# EAGLE design MainBoard (EAGLE 5.06)
TITLE: Matrix Main Board

## Sheet 1 of 2
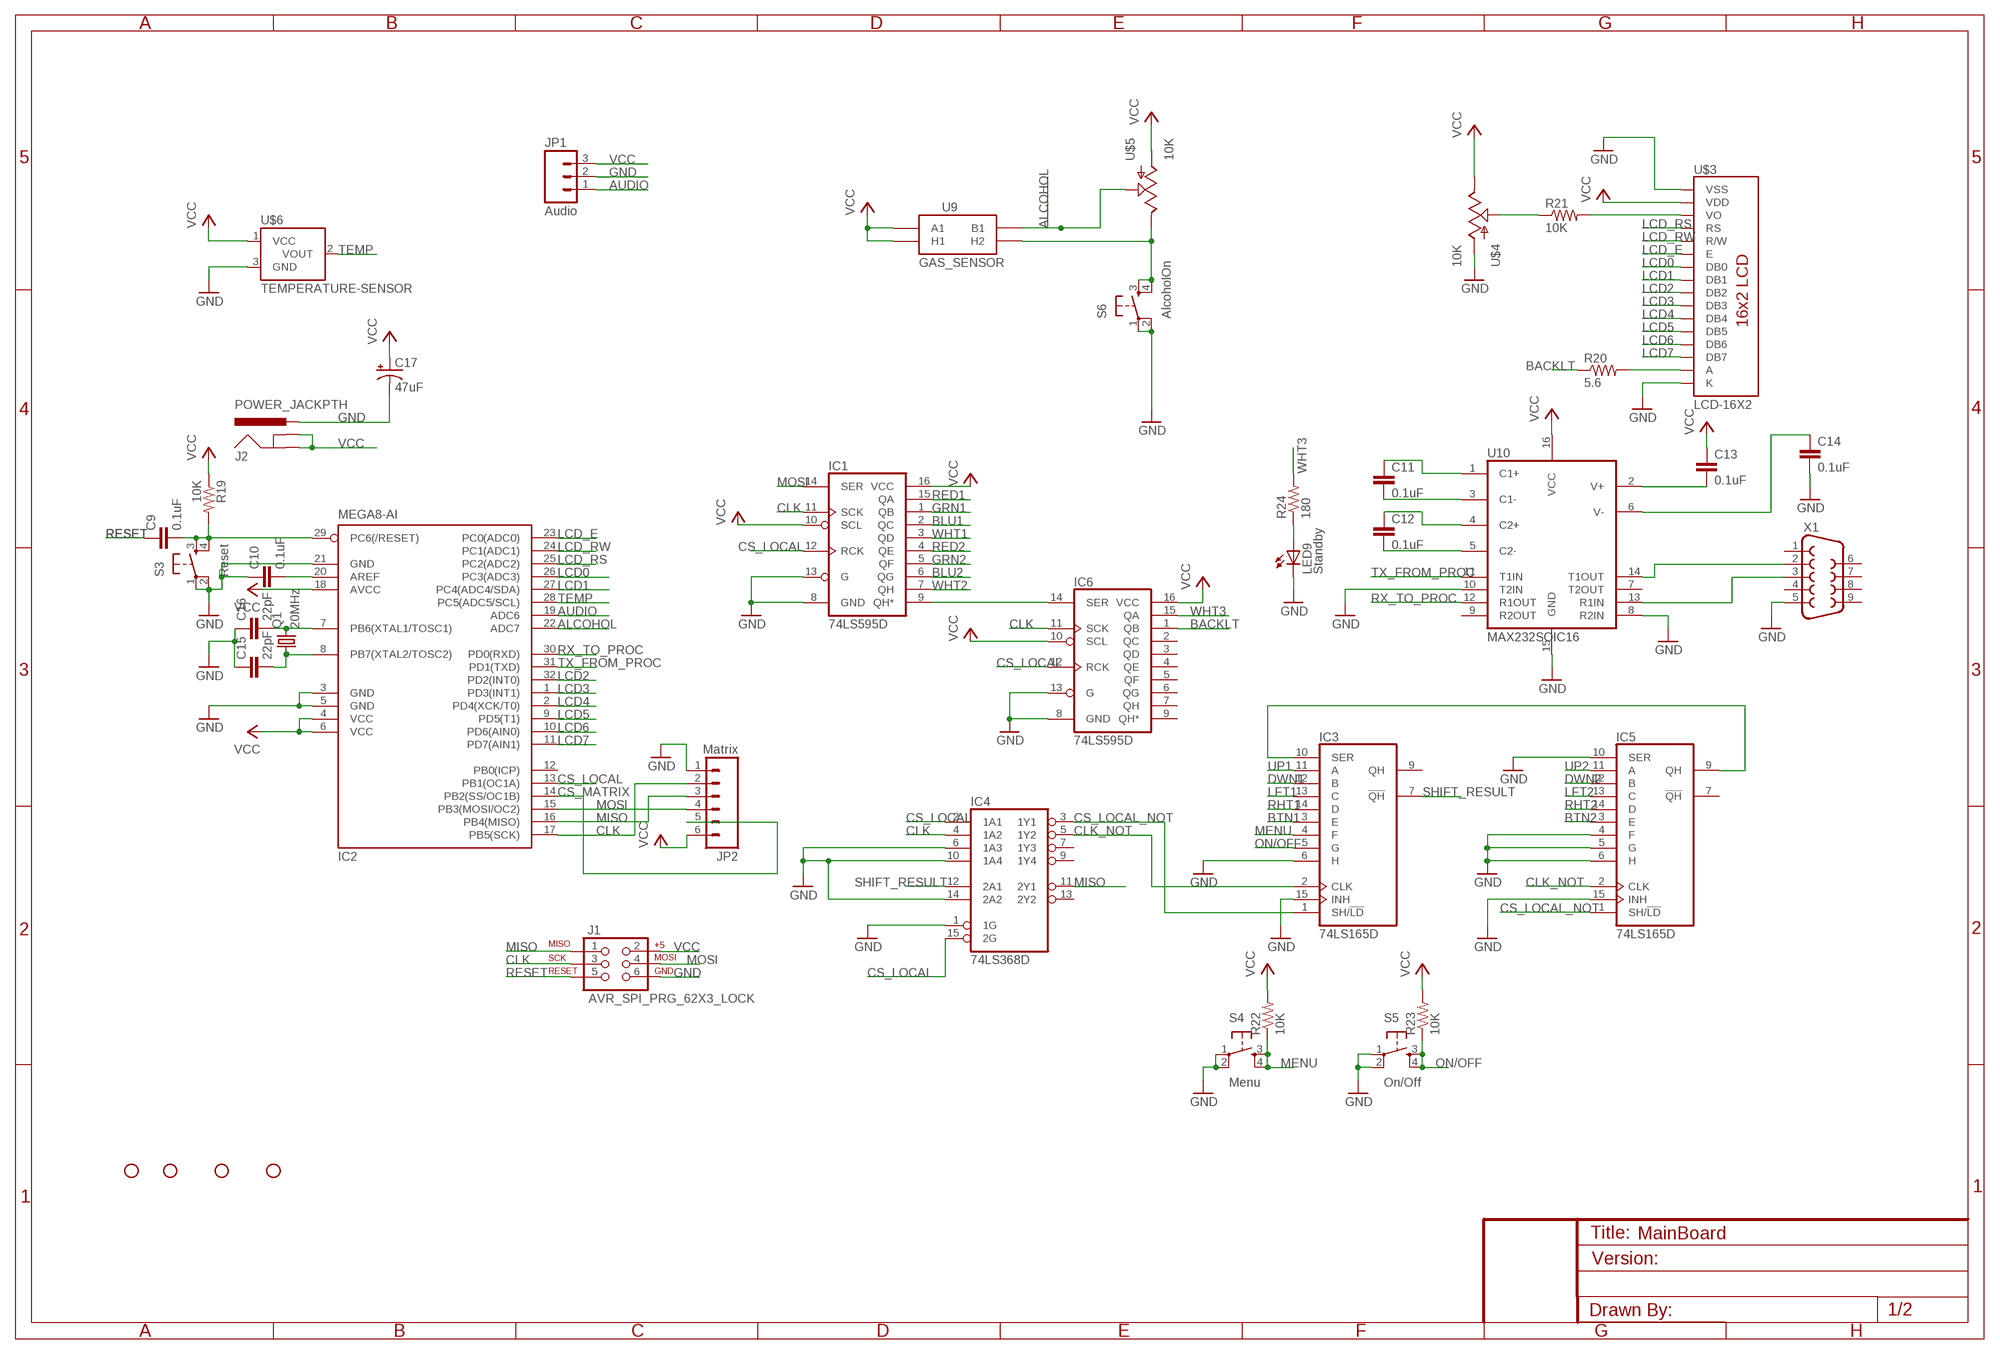
[diagram p0: schematic, sheet 1]

### Parts
C9  0.1uF  CAP0402-CAP  [0402-CAP]
C10  0.1uF  CAP0402-CAP  [0402-CAP]
C11  0.1uF  CAP0402-CAP  [0402-CAP]
C12  0.1uF  CAP0402-CAP  [0402-CAP]
C13  0.1uF  CAP0402-CAP  [0402-CAP]
C14  0.1uF  CAP0402-CAP  [0402-CAP]
C15  22pF  CAP0402-CAP  [0402-CAP]
C16  22pF  CAP0402-CAP  [0402-CAP]
C17  47uF  CAP_POLPTH2  [CPOL-RADIAL-10UF-25V]
IC1  74LS595D  [SO16]
IC2  MEGA8-AI  [TQFP32-08]
IC3  74LS165D  [SO16]
IC4  74LS368D  [SO16]
IC5  74LS165D  [SO16]
IC6  74LS595D  [SO16]
J1  AVR_SPI_PRG_62X3_LOCK  [2X3_LOCK]
J2  POWER_JACKPTH  [POWER_JACK_PTH]
JP1  Audio  M03PTH  [1X03]
JP2  Matrix  M06SIP  [1X06]
JP3  STAND-OFF  [STAND-OFF]
JP4  STAND-OFF  [STAND-OFF]
JP5  STAND-OFF  [STAND-OFF]
JP6  STAND-OFF  [STAND-OFF]
LED9  Standby  LED0603  [LED-0603]
Q1  20MHz  CRYSTALHC49US  [HC49US]
R19  10K  RESISTOR0402-RES  [0402-RES]
R20  5.6  RESISTOR0402-RES  [0402-RES]
R21  10K  RESISTOR0402-RES  [0402-RES]
R22  10K  RESISTOR0402-RES  [0402-RES]
R23  10K  RESISTOR0402-RES  [0402-RES]
R24  180  RESISTOR0402-RES  [0402-RES]
S3  Reset  TAC_SWITCHSMD  [TACTILE_SWITCH_SMD]
S4  Menu  TAC_SWITCHPTH  [TACTILE-PTH]
S5  On/Off  TAC_SWITCHPTH  [TACTILE-PTH]
S6  AlcoholOn  TAC_SWITCHSMD  [TACTILE_SWITCH_SMD]
U9  GAS_SENSOR  [MQ-3]
U10  MAX232SOIC16  [SO016]
U$3  LCD-16X2  [LCD-16X2]
U$4  10K  POTTRIM  [TRIM_POT]
U$5  10K  POTTRIM  [TRIM_POT]
U$6  TEMPERATURE-SENSOR  [TO-92]
X1  DB9  [DB9]

### Nets
ALCOHOL: IC2.22(ADC7) U9.B1 U$5.1(S)
AUDIO: IC2.19(ADC6) JP1.1
BACKLT: IC6.1(QB) R20.1
BLU1: IC1.2(QC) ; also sheet 2
BLU2: IC1.6(QG) ; also sheet 2
BTN1: IC3.3(E) ; also sheet 2
BTN2: IC5.3(E) ; also sheet 2
CLK: IC1.11(SCK) IC2.17(PB5(SCK)) IC4.4(1A2) IC6.11(SCK) J1.3 JP2.2
CLK_NOT: IC3.2(CLK) IC4.5(1Y2) IC5.2(CLK)
CS_LOCAL: IC1.12(RCK) IC2.13(PB1(OC1A)) IC4.2(1A1) IC4.15(2G) IC6.12(RCK)
CS_LOCAL_NOT: IC3.1(SH/!LD) IC4.3(1Y1) IC5.1(SH/!LD)
CS_MATRIX: IC2.14(PB2(SS/OC1B)) JP2.5
DWN1: IC3.12(B) ; also sheet 2
DWN2: IC5.12(B) ; also sheet 2
GND: C10.1 C14.2 C15.1 C16.1 C17.2(-) IC1.8(GND) IC1.13(G) IC2.3(GND) IC2.5(GND) IC2.21(GND) IC3.6(H) IC3.15(INH) IC4.1(1G) IC4.6(1A3) IC4.10(1A4) IC4.14(2A2) IC5.4(F) IC5.5(G) IC5.6(H) IC5.10(SER) IC5.15(INH) IC6.8(GND) IC6.13(G) J1.6 J2.PWR JP1.2 JP2.1 LED9.C S3.1 S3.2 S4.1 S4.2 S5.1 S5.2 S6.1 S6.2 U10.8(R2IN) U10.10(T2IN) U10.15(GND) U$3.1(VSS) U$3.16(K) U$4.3(A) U$6.3(GND) X1.5 ; also sheet 2
GRN1: IC1.1(QB) ; also sheet 2
GRN2: IC1.5(QF) ; also sheet 2
LCD0: IC2.26(PC3(ADC3)) U$3.7(DB0)
LCD1: IC2.27(PC4(ADC4/SDA)) U$3.8(DB1)
LCD2: IC2.32(PD2(INT0)) U$3.9(DB2)
LCD3: IC2.1(PD3(INT1)) U$3.10(DB3)
LCD4: IC2.2(PD4(XCK/T0)) U$3.11(DB4)
LCD5: IC2.9(PD5(T1)) U$3.12(DB5)
LCD6: IC2.10(PD6(AIN0)) U$3.13(DB6)
LCD7: IC2.11(PD7(AIN1)) U$3.14(DB7)
LCD_E: IC2.23(PC0(ADC0)) U$3.6(E)
LCD_RS: IC2.25(PC2(ADC2)) U$3.4(RS)
LCD_RW: IC2.24(PC1(ADC1)) U$3.5(R/W)
LFT1: IC3.13(C) ; also sheet 2
LFT2: IC5.13(C) ; also sheet 2
MENU: IC3.4(F) R22.1 S4.3 S4.4
MISO: IC2.16(PB4(MISO)) IC4.11(2Y1) J1.1 JP2.3
MOSI: IC1.14(SER) IC2.15(PB3(MOSI/OC2)) J1.4 JP2.4
N$5: LED9.A R24.1
N$6: C11.1 U10.1(C1+)
N$7: C9.2 IC2.29(PC6(/RESET)) R19.2 S3.3 S3.4
N$8: C10.2 IC2.20(AREF)
N$9: C11.2 U10.3(C1-)
N$14: C16.2 IC2.7(PB6(XTAL1/TOSC1)) Q1.2
N$15: S6.3 S6.4 U9.HB(H2) U$5.2(E)
N$16: IC3.10(SER) IC5.9(QH)
N$17: R21.2 U$3.3(VO)
N$18: R21.1 U$4.1(S)
N$19: C12.1 U10.4(C2+)
N$20: R20.2 U$3.15(A)
N$21: C12.2 U10.5(C2-)
N$22: C14.1 U10.6(V-)
N$23: C13.2 U10.2(V+)
N$24: U10.14(T1OUT) X1.2
N$25: U10.13(R1IN) X1.3
N$26: C15.2 IC2.8(PB7(XTAL2/TOSC2)) Q1.1
N$27: IC1.9(QH*) IC6.14(SER)
ON/OFF: IC3.5(G) R23.1 S5.3 S5.4
RED1: IC1.15(QA) ; also sheet 2
RED2: IC1.4(QE) ; also sheet 2
RESET: C9.1 J1.5
RHT1: IC3.14(D) ; also sheet 2
RHT2: IC5.14(D) ; also sheet 2
RX_TO_PROC: IC2.30(PD0(RXD)) U10.12(R1OUT)
SHIFT_RESULT: IC3.7(!QH) IC4.12(2A1)
TEMP: IC2.28(PC5(ADC5/SCL)) U$6.2(VOUT)
TX_FROM_PROC: IC2.31(PD1(TXD)) U10.11(T1IN)
UP1: IC3.11(A) ; also sheet 2
UP2: IC5.11(A) ; also sheet 2
VCC: C13.1 C17.1(+) IC1.10(SCL) IC1.16(VCC) IC2.4(VCC) IC2.6(VCC) IC2.18(AVCC) IC6.10(SCL) IC6.16(VCC) J1.2 J2.GND J2.GNDBREAK JP1.3 JP2.6 R19.1 R22.2 R23.2 U9.A1 U9.HA(H1) U10.16(VCC) U$3.2(VDD) U$4.2(E) U$5.3(A) U$6.1(VCC) ; also sheet 2
WHT1: IC1.3(QD) ; also sheet 2
WHT2: IC1.7(QH) ; also sheet 2
WHT3: IC6.15(QA) R24.2
Unconnected: IC2.12(PB0(ICP)) IC3.9(QH) IC4.7(1Y3) IC4.9(1Y4) IC4.13(2Y2) IC5.7(!QH) IC6.2(QC) IC6.3(QD) IC6.4(QE) IC6.5(QF) IC6.6(QG) IC6.7(QH) IC6.9(QH*) U10.7(T2OUT) U10.9(R2OUT) X1.1 X1.4 X1.6 X1.7 X1.8 X1.9

## Sheet 2 of 2
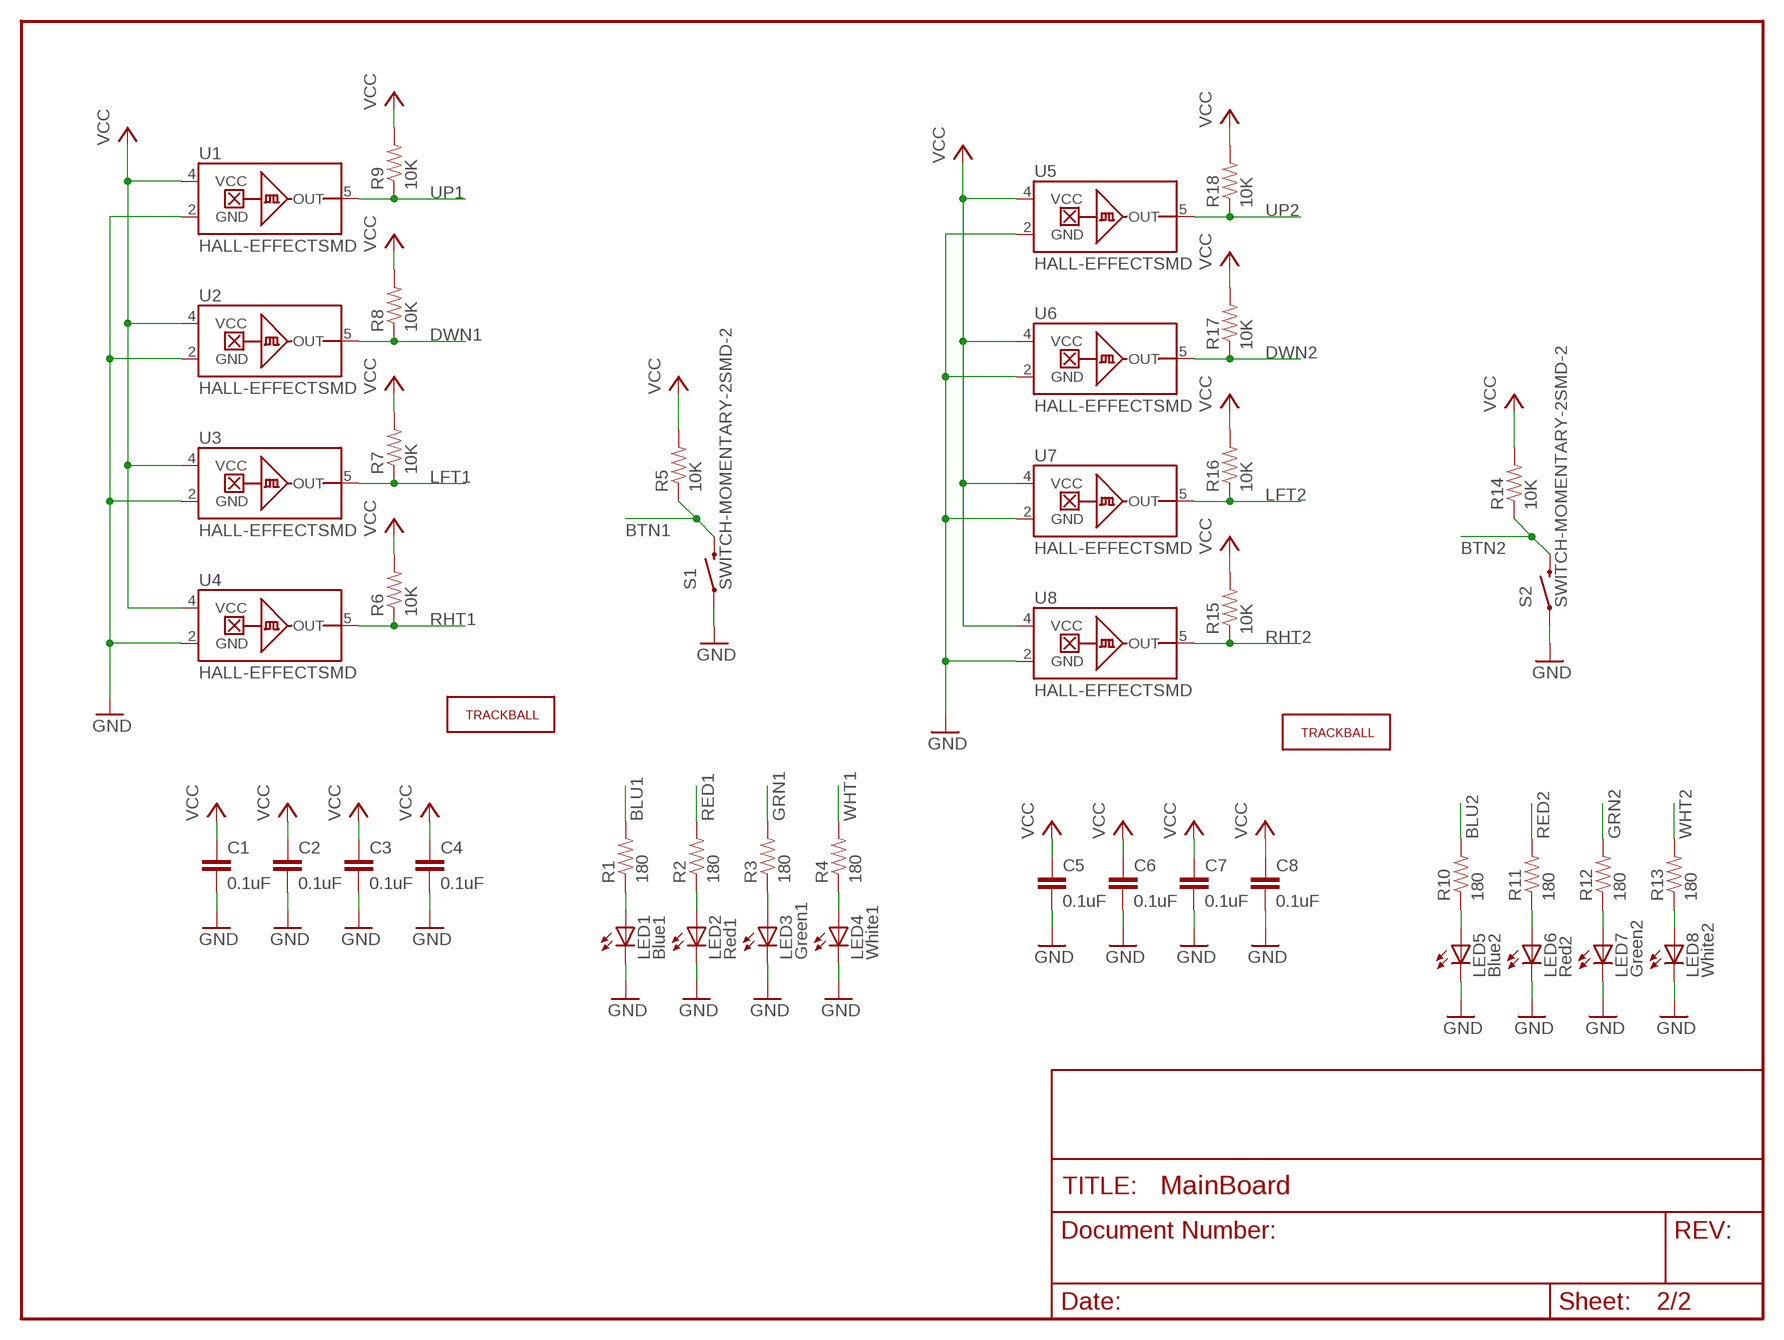
[diagram p1: schematic, sheet 2]

### Parts
C1  0.1uF  CAP0402-CAP  [0402-CAP]
C2  0.1uF  CAP0402-CAP  [0402-CAP]
C3  0.1uF  CAP0402-CAP  [0402-CAP]
C4  0.1uF  CAP0402-CAP  [0402-CAP]
C5  0.1uF  CAP0402-CAP  [0402-CAP]
C6  0.1uF  CAP0402-CAP  [0402-CAP]
C7  0.1uF  CAP0402-CAP  [0402-CAP]
C8  0.1uF  CAP0402-CAP  [0402-CAP]
LED1  Blue1  LED0603  [LED-0603]
LED2  Red1  LED0603  [LED-0603]
LED3  Green1  LED0603  [LED-0603]
LED4  White1  LED0603  [LED-0603]
LED5  Blue2  LED0603  [LED-0603]
LED6  Red2  LED0603  [LED-0603]
LED7  Green2  LED0603  [LED-0603]
LED8  White2  LED0603  [LED-0603]
R1  180  RESISTOR0402-RES  [0402-RES]
R2  180  RESISTOR0402-RES  [0402-RES]
R3  180  RESISTOR0402-RES  [0402-RES]
R4  180  RESISTOR0402-RES  [0402-RES]
R5  10K  RESISTOR0402-RES  [0402-RES]
R6  10K  RESISTOR0402-RES  [0402-RES]
R7  10K  RESISTOR0402-RES  [0402-RES]
R8  10K  RESISTOR0402-RES  [0402-RES]
R9  10K  RESISTOR0402-RES  [0402-RES]
R10  180  RESISTOR0402-RES  [0402-RES]
R11  180  RESISTOR0402-RES  [0402-RES]
R12  180  RESISTOR0402-RES  [0402-RES]
R13  180  RESISTOR0402-RES  [0402-RES]
R14  10K  RESISTOR0402-RES  [0402-RES]
R15  10K  RESISTOR0402-RES  [0402-RES]
R16  10K  RESISTOR0402-RES  [0402-RES]
R17  10K  RESISTOR0402-RES  [0402-RES]
R18  10K  RESISTOR0402-RES  [0402-RES]
S1  SWITCH-MOMENTARY-2SMD-2  [TACTILE_SWITCH_SMD-2]
S2  SWITCH-MOMENTARY-2SMD-2  [TACTILE_SWITCH_SMD-2]
U1  HALL-EFFECTSMD  [SC70]
U2  HALL-EFFECTSMD  [SC70]
U3  HALL-EFFECTSMD  [SC70]
U4  HALL-EFFECTSMD  [SC70]
U5  HALL-EFFECTSMD  [SC70]
U6  HALL-EFFECTSMD  [SC70]
U7  HALL-EFFECTSMD  [SC70]
U8  HALL-EFFECTSMD  [SC70]
U$1  TRACKBALLMECH  [TRACKBALL]
U$2  TRACKBALLMECH  [TRACKBALL]

### Nets
BLU1: R1.2 ; also sheet 1
BLU2: R10.2 ; also sheet 1
BTN1: R5.1 S1.1 ; also sheet 1
BTN2: R14.1 S2.1 ; also sheet 1
DWN1: R8.1 U2.5(OUT) ; also sheet 1
DWN2: R17.1 U6.5(OUT) ; also sheet 1
GND: C1.2 C2.2 C3.2 C4.2 C5.2 C6.2 C7.2 C8.2 LED1.C LED2.C LED3.C LED4.C LED5.C LED6.C LED7.C LED8.C S1.2 S2.2 U1.2(GND) U2.2(GND) U3.2(GND) U4.2(GND) U5.2(GND) U6.2(GND) U7.2(GND) U8.2(GND) ; also sheet 1
GRN1: R3.2 ; also sheet 1
GRN2: R12.2 ; also sheet 1
LFT1: R7.1 U3.5(OUT) ; also sheet 1
LFT2: R16.1 U7.5(OUT) ; also sheet 1
N$1: LED1.A R1.1
N$2: LED2.A R2.1
N$3: LED3.A R3.1
N$4: LED4.A R4.1
N$10: LED5.A R10.1
N$11: LED6.A R11.1
N$12: LED7.A R12.1
N$13: LED8.A R13.1
RED1: R2.2 ; also sheet 1
RED2: R11.2 ; also sheet 1
RHT1: R6.1 U4.5(OUT) ; also sheet 1
RHT2: R15.1 U8.5(OUT) ; also sheet 1
UP1: R9.1 U1.5(OUT) ; also sheet 1
UP2: R18.1 U5.5(OUT) ; also sheet 1
VCC: C1.1 C2.1 C3.1 C4.1 C5.1 C6.1 C7.1 C8.1 R5.2 R6.2 R7.2 R8.2 R9.2 R14.2 R15.2 R16.2 R17.2 R18.2 U1.4(VCC) U2.4(VCC) U3.4(VCC) U4.4(VCC) U5.4(VCC) U6.4(VCC) U7.4(VCC) U8.4(VCC) ; also sheet 1
WHT1: R4.2 ; also sheet 1
WHT2: R13.2 ; also sheet 1

## Power pins joined to a net without a drawn wire
GND: IC3.8(GND) IC4.8(GND) IC5.8(GND)
VCC: IC3.16(VCC) IC4.16(VCC) IC5.16(VCC)

## Library data of the parts
C1-C16 = SparkFun:CAP: Capacitor Standard 0603 ceramic capacitor, and 0.1" leaded capacitor.
C17 = SparkFun:CAP_POL: Capacitor Polarized These are standard SMD and PTH capacitors. Normally 10uF, 47uF, and 100uF in electrolytic and tantalum varieties. Always verify the external diameter of the through hole cap, it varies with capacity, voltage, and manufacturer. The EIA devices should be standard.
IC1 IC6 = SparkFun:74*595: 8-bit SHIFT REGISTER, output latch
IC2 = atmel:MEGA8: MICROCONTROLLER 8 Kbytes FLASH, 1 kbytes SRAM, 512 bytes EEPROM, USART, 6-channel 10 bit ADC, 2-channel 8 bit ADC Pin compatible with Atmega48, ATMega88, ATMega168 Source: avr.lbr
IC3 IC5 = 74xx-us:74*165: 8-bit parallel load SHIFT REGISTER
IC4 = 74xx-us:74*368: Hex BUS DRIVER, 3-state
J1 = SparkFun:AVR_SPI_PRG_6: AVR ISP 6 Pin This is the reduced ISP connector for AVR programming. Common on Arduino. This footprint will take up less PCB space and can be used with a 10-pin to 6-pin adapter such as SKU: BOB-08508
J2 = SparkFun:POWER_JACK: Power Jack This is the standard 5.5mm barrel jack for power. The PTH is the most common, proven, reliable, footprint. All others are experimental. The Slot footprint only works if the mill layer is transmitted to the PCB fab house so be warned. Spark Fun Electronics SKU : PRT-00119. Mating wall wart : TOL-00298 (and others)
JP1 = SparkFun:M03: Header 3 Standard 3-pin 0.1" header. Use with straight break away headers (SKU : PRT-00116), right angle break away headers (PRT-00553), swiss pins (PRT-00743), machine pins (PRT-00117), and female headers (PRT-00115). Molex polarized connector foot print use with SKU : PRT-08232 with associated crimp pins and housings.
JP2 = SparkFun:M06: Header 6 Standard 6-pin 0.1" header. Use with straight break away headers (SKU : PRT-00116), right angle break away headers (PRT-00553), swiss pins (PRT-00743), machine pins (PRT-00117), and female headers (PRT-00115). Molex polarized connector foot print use with SKU : PRT-08094 with associated crimp pins and housings. NOTES ON THE VARIANTS LOCK and LOCK_LONGPADS... This footprint was designed to help hold the alignment of a through-hole component (i.e. 6-pin header) while soldering it into place. You may notice that each hole has been shifted either up or down by 0.005 of an inch from it's more standard position (which is a perfectly straight line). This slight alteration caused the pins (the squares in the middle) to touch the edges of the holes. Because they are alternating, it causes a "brace" to hold the component in place. 0.005 has proven to be the perfect amount of "off-center" position when using our standard breakaway headers. Although looks a little odd when you look at the bare footprint, once you have a header in there, the alteration is very hard to notice. Also, if you push a header all the way into place, it is covered up entirely on the bottom side. This idea of altering the position of holes to aid alignment will be further integrated into the Sparkfun Library for other footprints. It can help hold any component with 3 or more connection pins.
JP3-JP6 = SparkFun:STAND-OFF: Stand Off This is the mechanical footprint for a #4 phillips button head screw. Use the keepout ring to avoid running the screw head into surrounding components. SKU : PRT-00447
LED1-LED9 = SparkFun:LED: LEDs Standard schematic elements and footprints for 5mm, 3mm, 1206, and 0603 sized LEDs. 5mm - Spark Fun Electronics SKU : COM-00529 (and others)
Q1 = SparkFun:CRYSTAL: Crystals Various standard crystals. Proven footprints. Spark Fun Electronics SKU : COM-00534
R1-R24 = SparkFun:RESISTOR: Resistor Basic schematic elements and footprints for 0603, 1206, and PTH 1/10th watt (small) resistors.
S1 S2 = SparkFun:SWITCH-MOMENTARY-2
S3-S6 = SparkFun:TAC_SWITCH: Momentary Switch Button commonly used for reset or general input. Spark Fun Electronics SKU : COM-00097
U1-U8 = SparkFun:HALL-EFFECT
U9 = SparkFun:GAS_SENSOR: MQ-3 Gas Sensor. FP not tested. Part#
U10 = SparkFun:MAX232: RS232 Transceiver Very common IC. This is generically called 'MAX232', but works with the 3V equivalent MAX3232 generic ICs. Field tested and mother approved. Spark Fun Electronics SKU : COM-00316 (DIP) and COM-00589 (SMD)
U$1 U$2 = SparkFun:TRACKBALL
U$3 = SparkFun:LCD-16X2
U$4 U$5 = SparkFun:POT
U$6 = SparkFun:TEMPERATURE-SENSOR
X1 = SparkFun:DB9: DB9 Connector Standard DB9 (D-Sub 9) serial connector. Can be used for CAN bus as well as RS485 and RS232. Footprint production proven. Spark Fun Electronics SKU : PRT-00429

## Board
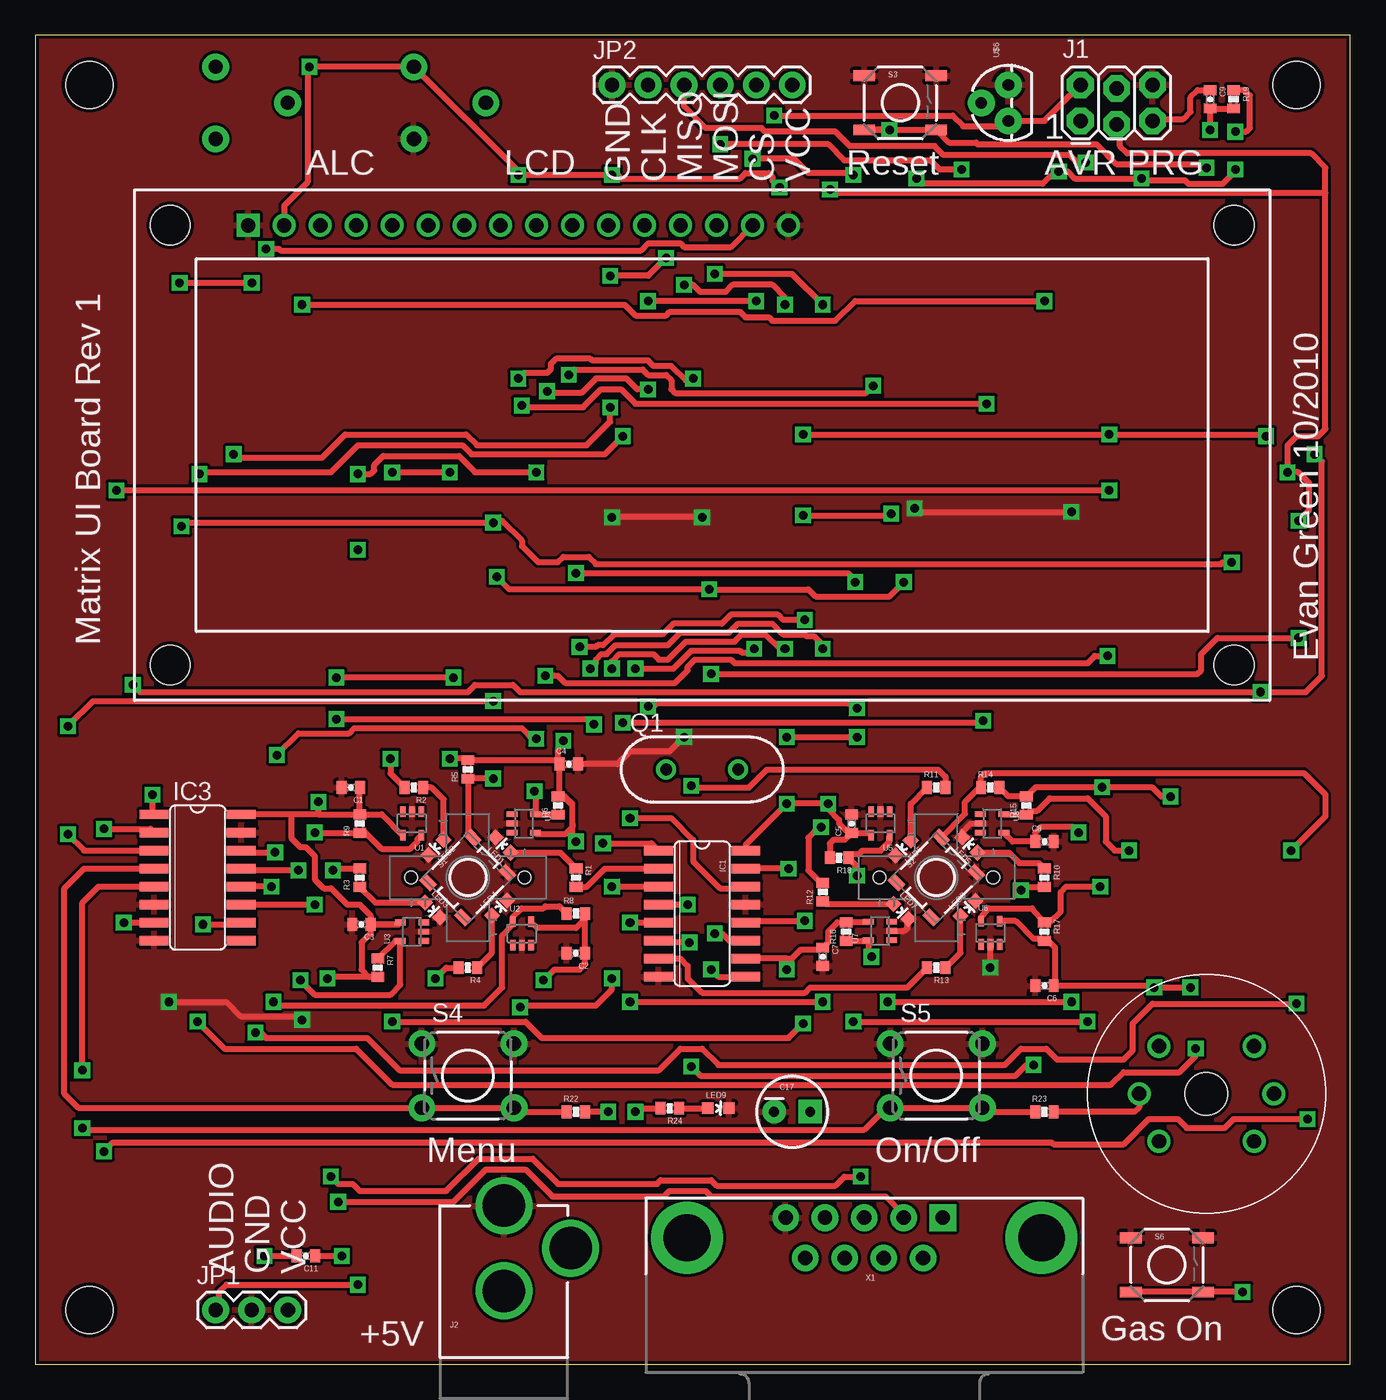
[diagram p2: board, top side]
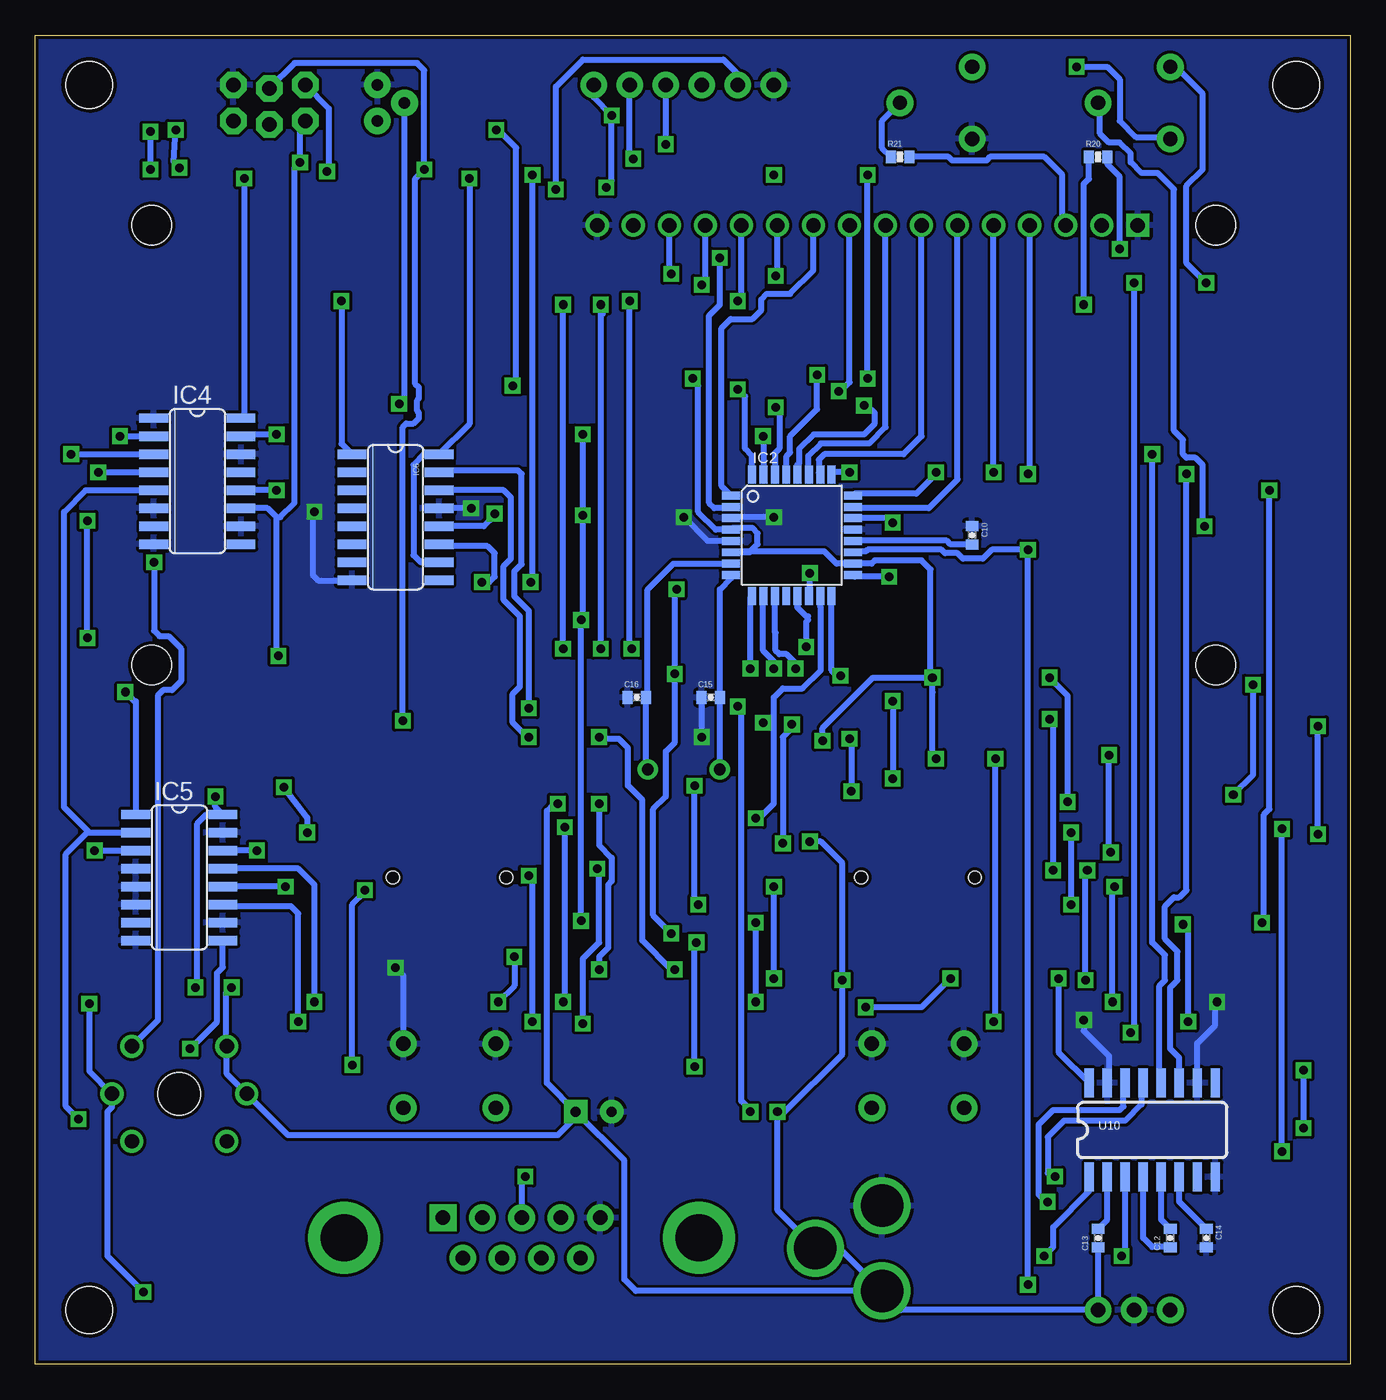
[diagram p3: board, bottom side, seen from below]

Size 92.69 x 93.65 mm. Coordinates in mm from the lower left corner, seen from the top.
Outline: 0,0 92.69,0 92.69,93.65 0,93.65 0,0
Copper layers (1*16): Top 0.035mm / dielectric 1.5mm / Bottom 0.035mm
Design rules "SparkFun": minimum track width 8mil, minimum drill 20mil, track to track 8mil, track to pad 8mil, pad to pad 8mil, via to via 8mil, smd to smd 8mil, copper to edge 10mil, drill to drill 8mil, minimum pad ring 12mil, minimum via ring 10mil, stop-mask expansion 4mil, vias tented up to drill 25mil, thermal gap 10mil

### Footprints (pad centres in the part's own frame; a part is rotated, then mirrored left to right if it is on the bottom)
0402-CAP = smd 0.7 x 0.9: 1 -0.65,0; 2 0.65,0
CPOL-RADIAL-10UF-25V = drill 0.7 pad 1.651 square: 1 1.27,0 | drill 0.7 pad 1.651 round: 2 -1.27,0
SO16 = smd 0.66 x 2.032: 1 -4.445,-3.073; 2 -3.175,-3.073; 3 -1.905,-3.073; 4 -0.635,-3.073; 5 0.635,-3.073; 6 1.905,-3.073; 7 3.175,-3.073; 8 4.445,-3.073; 9 4.445,3.073; 10 3.175,3.073; 11 1.905,3.073; 12 0.635,3.073; 13 -0.635,3.073; 14 -1.905,3.073; 15 -3.175,3.073; 16 -4.445,3.073
TQFP32-08 = smd 1.27 x 0.559: 1 -4.293,2.8; 2 -4.293,2; 3 -4.293,1.2; 4 -4.293,0.4; 5 -4.293,-0.4; 6 -4.293,-1.2; 7 -4.293,-2; 8 -4.293,-2.8; 17 4.293,-2.8; 18 4.293,-2; 19 4.293,-1.2; 20 4.293,-0.4; 21 4.293,0.4; 22 4.293,1.2; 23 4.293,2; 24 4.293,2.8 | smd 0.559 x 1.27: 9 -2.8,-4.293; 10 -2,-4.293; 11 -1.2,-4.293; 12 -0.4,-4.293; 13 0.4,-4.293; 14 1.2,-4.293; 15 2,-4.293; 16 2.8,-4.293; 25 2.8,4.293; 26 2,4.293; 27 1.2,4.293; 28 0.4,4.293; 29 -0.4,4.293; 30 -1.2,4.293; 31 -2,4.293; 32 -2.8,4.293
2X3_LOCK = drill 1.016 pad 1.88 octagon: 1 0,0; 2 0,2.54; 3 2.54,-0.254; 4 2.54,2.286; 5 5.08,0; 6 5.08,2.54
POWER_JACK_PTH = drill 2.997 round: GND 0,7.7; GNDBREAK 4.7,10.7; PWR 0,13.7
1X03 = drill 1.016 pad 1.88 round: 1 0,0; 2 2.54,0; 3 5.08,0
1X06 = drill 1.016 pad 1.88 round: 1 0,0; 2 2.54,0; 3 5.08,0; 4 7.62,0; 5 10.16,0; 6 12.7,0
STAND-OFF = hole 3.302: 0,0
LED-0603 = smd 0.8 x 0.8: A 0,-0.75; C 0,0.75
HC49US = drill 0.813 round: 1 -2.54,0; 2 2.54,0
0402-RES = smd 0.7 x 0.9: 1 -0.65,0; 2 0.65,0
TACTILE_SWITCH_SMD-2 = smd 0.7 x 1.1: 1 2.225,1.75; 2 2.225,-1.75; 3 -2.225,-1.75; 4 -2.225,1.75
TACTILE_SWITCH_SMD = smd 1.524 x 0.762: 1 -2.54,1.905; 2 2.54,1.905; 3 -2.54,-1.905; 4 2.54,-1.905
TACTILE-PTH = drill 1.016 pad 1.88 round: 1 -3.251,2.261; 2 3.251,2.261; 3 -3.251,-2.261; 4 3.251,-2.261
SC70 = smd 0.4 x 0.75: 1 -0.65,-0.825; 2 0,-0.825; 3 0.65,-0.825; 4 0.65,0.825; 5 -0.65,0.825
MQ-3 = drill 1.016 round: A1 -3.35,3.35; A2 -3.35,-3.35; B1 3.35,3.35; B2 3.35,-3.35; HA -4.75,0; HB 4.75,0 | hole 3: 0,0
SO016 = smd 0.66 x 2.032: 1 -4.445,-3.315; 2 -3.175,-3.315; 3 -1.905,-3.315; 4 -0.635,-3.315; 5 0.635,-3.315; 6 1.905,-3.315; 7 3.175,-3.315; 8 4.445,-3.315; 9 4.445,3.315; 10 3.175,3.315; 11 1.905,3.315; 12 0.635,3.315; 13 -0.635,3.315; 14 -1.905,3.315; 15 -3.175,3.315; 16 -4.445,3.315
TRACKBALL = hole 0.9: -4,0; 4,0
LCD-16X2 = drill 1.016 square: 1 -32,15.5 | drill 1.016 round: 2 -29.46,15.5; 3 -26.92,15.5; 4 -24.38,15.5; 5 -21.84,15.5; 6 -19.3,15.5; 7 -16.76,15.5; 8 -14.22,15.5; 9 -11.68,15.5; 10 -9.14,15.5; 11 -6.6,15.5; 12 -4.06,15.5; 13 -1.52,15.5; 14 1.02,15.5; 15 3.56,15.5; 16 6.1,15.5 | hole 2.8: -37.5,15.5; -37.5,-15.5; 37.5,15.5; 37.5,-15.5
TRIM_POT = drill 1 pad 1.88 round: 1 5.08,0; 2 0,2.54; 3 0,-2.54
TO-92 = drill 0.813 pad 1.88 round: 1 -1.27,0; 2 0,1.905; 3 1.27,0
DB9 = drill 1.016 pad 1.88 square: 1 -5.54,-1.42 | drill 1.016 pad 1.88 round: 2 -2.77,-1.42; 3 0,-1.42; 4 2.77,-1.42; 5 5.54,-1.42; 6 -4.15,1.42; 7 -1.38,1.42; 8 1.38,1.42; 9 4.15,1.42 | drill 3.302 pad 5.08 round: G1 -12.5,0; G2 12.5,0

### Placement (x,y rotation side)
C1  22.23,40.64 180 top
C2  38.1,28.96 180 top
C3  22.99,30.99 180 top
C4  37.59,42.29 0 top
C5  57.53,38.1 90 top
C6  71.12,26.67 180 top
C7  55.5,28.7 270 top
C8  71.12,36.83 0 top
C9  82.8,89.15 270 top
C10  26.67,58.42 270 bottom
C11  19.05,7.62 180 top
C12  12.7,8.89 90 bottom
C13  17.78,8.89 90 bottom
C14  10.16,8.89 270 bottom
C15  45.09,46.99 0 bottom
C16  50.29,46.99 0 bottom
C17  53.34,17.78 0 top
IC1  46.99,31.75 270 top
IC2  39.37,58.42 0 bottom
IC3  11.43,34.29 270 top
IC4  81.28,62.23 270 bottom
IC5  82.55,34.29 270 bottom
IC6  67.31,59.69 270 bottom
J1  73.66,87.63 0 top
J2  33.02,-2.54 0 top
JP1  12.7,3.81 0 top
JP2  40.64,90.17 0 top
JP3  3.81,3.81 0 top
JP4  88.9,3.81 0 top
JP5  88.9,90.17 0 top
JP6  3.81,90.17 0 top
LED1  32.97,36.58 45 top
LED2  28.24,36.42 135 top
LED3  27.99,32 225 top
LED4  32.72,32.16 315 top
LED5  65.86,36.58 45 top
LED6  61.16,36.37 135 top
LED7  61.01,31.9 225 top
LED8  65.74,32.11 315 top
LED9  48.13,18.03 270 top
Q1  46.99,41.91 0 top
R1  38.1,34.29 270 top
R2  26.67,40.64 180 top
R3  22.86,34.29 90 top
R4  30.48,27.94 180 top
R5  30.48,41.91 90 top
R6  36.83,39.37 90 top
R7  24.13,27.94 270 top
R8  38.1,31.75 0 top
R9  22.86,38.1 90 top
R10  71.12,34.29 270 top
R11  63.5,40.64 0 top
R12  55.5,33.27 90 top
R13  63.5,27.94 180 top
R14  67.31,40.64 0 top
R15  69.85,39.37 90 top
R16  57.15,30.48 90 top
R17  71.12,30.48 270 top
R18  56.64,35.69 180 top
R19  84.45,89.15 270 top
R20  17.78,85.09 0 bottom
R21  31.75,85.09 0 bottom
R22  38.1,17.78 0 top
R23  71.12,17.78 0 top
R24  44.7,18.03 180 top
S1  30.48,34.29 45 top
S2  63.5,34.29 45 top
S3  60.96,88.9 0 top
S4  30.48,20.32 0 top
S5  63.5,20.32 0 top
S6  79.76,6.99 0 top
U1  26.54,38.1 180 top
U2  34.29,30.35 0 top
U3  26.54,30.48 90 top
U4  34.42,38.1 270 top
U5  59.56,38.1 180 top
U6  67.31,30.4 0 top
U7  59.54,30.53 90 top
U8  67.44,38.1 270 top
U9  82.55,19.05 0 top
U10  13.97,16.51 0 bottom
U$1  63.5,34.29 0 top
U$2  30.48,34.29 0 top
U$3  46.99,64.77 0 top
U$4  26.67,88.9 0 top
U$5  12.7,88.9 0 top
U$6  68.58,88.9 90 top
X1  58.42,8.89 180 top

### Tracks (layer width: path | path; a pad name or v marks a point on that pad's centre or on a via)
ALCOHOL  (via drill 0.6)
  Top 0.406: v84.33,56.52 83.69,56.52 83.57,56.39 39.5,56.39 38.99,56.9 37.21,56.9 36.83,56.52 35.43,56.52 34.29,57.66 34.29,58.04 32.89,59.44 v32.26,59.31 10.54,59.31 v10.29,59.05
  Bottom 0.406: U9.B1 84.07,24.23 84.07,47.12 83.69,47.5 83.06,47.5 82.42,48.13 82.42,50.42 83.31,51.31 83.95,51.31 84.33,51.69 v84.33,56.52 | v32.26,59.31 32.57,59.62 IC2.22 | U$5.1 17.65,88.77 17.65,86.74 17.02,86.11 16.26,86.11 15.49,85.34 15.49,84.71 14.73,83.95 13.59,83.95 12.45,82.8 12.45,65.79 11.81,65.15 11.81,64.14 11.56,63.88 10.92,63.88 10.41,63.37 10.41,59.56 10.29,59.44 v10.29,59.05
AUDIO  (via drill 0.6)
  Top 0.406: JP1.1 12.95,4.06 12.95,5.08 13.46,5.59 v22.73,5.59
  Bottom 0.406: v22.73,5.59 v22.73,57.4 25.27,57.4 25.91,56.77 27.3,56.77 27.69,57.15 28.57,57.15 28.83,57.4 34.04,57.4 34.16,57.28 35.02,57.28 IC2.19
BACKLT  (via drill 0.6)
  Top 0.406: v71.12,74.93 57.78,74.93 56.39,73.53 51.94,73.53 51.69,73.79 50.04,73.79 49.66,74.17 44.7,74.17 44.45,73.91 42.29,73.91 41.53,74.68 v18.8,74.68
  Bottom 0.406: IC6.1 71.12,64.87 v71.12,74.93 | v18.8,74.68 18.8,83.19 18.43,83.55 R20.1
BLU1
  Top 0.406: IC1.2 40.13,34.92 38.85,33.64 R1.2
BLU2  (via drill 0.6)
  Top 0.406: IC1.6 44.04,29.72 v46.1,29.72 | v46.23,20.95 46.86,20.32 69.09,20.32 69.85,21.08 v70.36,21.08 | v69.47,33.4 69.71,33.64 R10.2
  Bottom 0.406: v46.1,29.72 46.23,29.59 v46.23,20.95 | v70.36,21.08 70.36,32.38 69.47,33.27 v69.47,33.4
BTN1  (via drill 0.6)
  Top 0.406: S1.1 30.48,37.44 R5.1 30.5,41.27 v32.26,41.27 | v32.26,46.74 4.06,46.74 v2.29,44.96 | v2.29,37.34 3.43,36.2 IC3.3
  Bottom 0.406: v32.26,46.74 v32.26,41.27 | v2.29,37.34 v2.29,44.96
BTN2  (via drill 0.6)
  Top 0.406: S2.1 65.53,38.8 65.53,39.62 66.55,40.64 R14.1 66.66,41.39 66.93,41.66 89.41,41.66 90.93,40.13 90.93,38.61 v88.52,36.2
  Bottom 0.406: v88.52,36.2 IC5.3
CLK  (via drill 0.6)
  Top 0.406: IC1.11 48.9,29.84 48.39,30.35 v47.88,30.35 | v47.62,48.64 81.92,48.64 82.17,48.9 82.17,50.04 83.31,51.18 v89.03,51.18 | v89.03,59.44 89.79,60.2 89.79,62.1 89.03,62.87 v88.27,62.87 88.27,64.77 88.9,65.41 90.42,65.41 90.93,65.91 90.93,82.55 | J1.3 76.45,87.12 76.45,85.85 76.96,85.34 89.92,85.34 90.93,84.33 90.93,82.55 | v56.01,82.8 56.26,82.55 90.93,82.55 | v32.51,55.5 33.4,54.61 v47.5,54.61 54.48,54.61 54.99,54.1 60.2,54.1 v61.21,55.12
  Bottom 0.406: v89.03,51.18 v89.03,59.44 | v88.27,62.87 IC4.4 | v56.01,82.8 56.01,90.04 54.1,91.95 44.2,91.95 43.18,90.93 JP2.2 | v47.88,30.35 49.15,31.62 49.15,39.12 48.26,40.01 48.26,43.18 47.62,43.81 v47.62,48.64 47.62,54.48 v47.5,54.61 | IC2.17 34.96,55.5 v32.51,55.5 | IC6.11 64.11,57.66 60.83,57.66 60.33,57.15 60.33,55.5 60.71,55.12 v61.21,55.12
CLK_NOT  (via drill 0.6)
  Top 0.406: IC3.2 8.1,37.72 v4.83,37.72 | v4.83,14.99 5.46,15.62 71.63,15.62 71.75,15.49 76.71,15.49 78.49,17.27 80.52,17.27 81.15,16.64 83.82,16.64 84.45,17.27 v89.66,17.27
  Bottom 0.406: v4.83,14.99 v4.83,37.72 | v89.66,17.27 90.55,18.16 90.55,35.94 89.03,37.47 88.9,37.47 | 88.9,37.47 IC5.2 | 88.9,37.47 90.68,39.24 90.68,60.07 89.15,61.59 IC4.5
CS_LOCAL  (via drill 0.6)
  Top 0.406: IC1.12 50.19,31.24 v54.23,31.24 | v86.74,65.41 86.61,65.53 v75.69,65.53 v54.1,65.53 | v54.23,52.45 52.7,52.45 52.32,52.83 49.02,52.83 48.39,52.2 44.96,52.2 44.2,51.44 40.77,51.44 40.01,50.67 39.62,50.67 39.5,50.55 v38.35,50.55 | v60.33,59.94 60.2,59.82 v54.1,59.82
  Bottom 0.406: v54.23,31.24 54.1,31.37 54.23,31.5 v54.23,52.45 54.1,52.58 54.1,58.42 v54.1,59.82 v54.1,65.53 | v86.74,65.41 IC4.2 | IC4.15 78.08,65.53 v75.69,65.53 | 38.99,54.11 IC2.13 38.97,53.45 38.99,53.43 38.99,53.34 38.35,52.7 38.23,52.7 38.23,52.45 38.35,52.32 v38.35,50.55 | IC6.12 61.09,59.05 60.33,59.82 v60.33,59.94
CS_LOCAL_NOT  (via drill 0.6)
  Top 0.406: IC3.1 8.26,38.84 v8.26,40.13 | v6.86,47.88 7.37,47.37 30.48,47.37 30.99,47.88 33.66,47.88 34.16,47.37 v86.36,47.37 89.53,47.37 90.68,48.51 90.68,63.63 v90.17,64.14
  Bottom 0.406: v8.26,40.13 6.86,41.53 v6.86,47.88 | v86.36,47.37 85.62,46.63 IC5.1 85.6,38.76 85.6,46.74 | v90.17,64.14 IC4.3
CS_MATRIX  (via drill 0.6)
  Top 0.406: v38.1,55.75 57.28,55.75 57.78,55.24 v57.78,55.12 | v57.66,83.82 57.53,83.95 54.48,83.95 53.47,84.96 v50.55,84.96
  Bottom 0.406: IC2.14 38.1,54.2 v38.1,55.75 | v57.78,55.12 57.66,55.24 v57.66,83.82 | v50.55,84.96 50.8,85.22 JP2.5
DWN1  (via drill 0.6)
  Top 0.406: R8.1 36.94,32.26 35.94,32.26 35.81,32.13 34.29,32.13 33.64,31.48 U2.5 33.64,30.97 32.89,30.23 32.89,26.54 31.62,25.27 17.02,25.27 v16.76,25.53 | v16.64,33.66 IC3.12
  Bottom 0.406: v16.64,33.66 16.76,33.53 v16.76,25.53
DWN2  (via drill 0.6)
  Top 0.406: U6.5 66.66,31.48 67.18,32.13 70.25,32.13 R17.1 71.52,31.13 72.26,31.88 72.26,33.27 72.64,33.66 v75.06,33.66
  Bottom 0.406: v75.06,33.66 IC5.12
GND  (via drill 0.6)
  Top 0.406: v18.8,24.26 18.54,24.51 14.48,24.51 13.46,25.53 v9.4,25.53 | v67.31,27.94 U6.2 | LED7.C 61.47,31.3 61.47,30.73 61.27,30.53 U7.2 | U8.2 65.91,38.1 65.33,37.52 LED5.C | v46.99,59.69 v40.64,59.69 | v61.98,60.33 62.23,60.07 v73.03,60.07 | v45.72,44.2 44.7,43.18 41.91,43.18 41.02,42.29 C4.2
  Bottom 0.406: U10.15 17.02,19.95 17.02,21.72 18.8,23.5 v18.8,24.26 | v9.4,25.53 9.53,25.4 9.53,23.88 10.79,22.61 U10.10 | v67.31,27.94 66.75,27.38 S5.2 | IC2.3 43.59,59.69 v40.64,59.69 | v46.99,59.69 45.32,58.02 IC2.5 | v61.98,60.33 IC6.13 | v73.03,60.07 73.15,59.94 73.15,55.63 72.77,55.24 IC6.8 | C15.1 45.72,46.98 v45.72,44.2
  pour Top: 0,93.98 0,0 92.71,0 92.71,93.98
  pour Bottom: 0,93.98 0,0 92.71,0 92.71,93.98
GRN1  (via drill 0.6)
  Top 0.406: IC1.1 43.41,36.7 v40.01,36.7 | v39.37,45.09 38.99,45.47 v21.21,45.47 | v20.95,34.8 21.1,34.94 R3.2
  Bottom 0.406: v21.21,45.47 20.95,45.21 v20.95,34.8 | v40.01,36.7 40.01,44.2 39.37,44.83 v39.37,45.09
GRN2  (via drill 0.6)
  Top 0.406: v41.91,31.11 IC1.5 | v41.91,25.53 v55.5,25.53 | R12.2 55.36,33.92 54.48,34.8 54.48,37.08 55.24,37.85 v55.37,37.85
  Bottom 0.406: v41.91,25.53 v41.91,31.11 | v55.5,25.53 55.37,25.65 v55.37,37.85
LCD0
  Bottom 0.406: IC2.26 37.47,62.81 37.47,63.75 37.08,64.14 31.5,64.14 30.23,65.4 U$3.7
LCD1
  Bottom 0.406: IC2.27 38.23,62.77 38.23,64.01 37.34,64.9 33.91,64.9 32.77,66.04 U$3.8
LCD2  (via drill 0.6)
  Top 0.406: v36.07,68.58 36.2,68.45 38.48,68.45 39.5,69.47 41.66,69.47 42.42,68.71 v43.18,68.71
  Bottom 0.406: U$3.9 35.31,69.22 35.94,68.58 v36.07,68.58 | v43.18,68.71 42.67,68.2 42.67,64.52 42.17,64.01 IC2.32
LCD3
  Bottom 0.406: IC2.1 44.32,61.88 44.32,73.03 43.69,73.66 42.16,73.66 41.53,74.3 41.53,75.06 41.15,75.44 39.5,75.44 37.85,77.08 U$3.10
LCD4  (via drill 0.6)
  Top 0.406: v44.45,77.98 43.18,76.71 v40.51,76.71
  Bottom 0.406: IC2.2 43.76,60.33 44.83,60.33 45.21,60.71 45.21,73.91 44.45,74.68 v44.45,77.98 | v40.51,76.71 40.39,76.83 U$3.11
LCD5  (via drill 0.6)
  Top 0.406: v50.8,74.93 v43.18,74.93 | v50.67,50.42 50.42,50.16 49.78,50.16 49.66,50.29 46.23,50.29 44.96,49.02 v42.29,49.02
  Bottom 0.406: IC2.9 42.29,54.01 v42.29,49.02 | v50.67,50.42 50.8,50.29 v50.8,74.93 | v43.18,74.93 42.93,75.18 U$3.12
LCD6  (via drill 0.6)
  Top 0.406: 52.58,50.42 v52.83,50.42 52.45,50.42 51.44,51.44 49.78,51.44 49.28,50.93 45.85,50.93 44.58,49.66 43.94,49.66 43.56,50.04 41.15,50.04 40.64,49.53 v40.64,49.02 | v52.83,74.68 52.83,75.18 51.94,76.07 49.15,76.07 48.64,75.56 46.86,75.56 46.35,76.07 v45.72,76.07
  Bottom 0.406: IC2.10 41.4,54.09 41.4,50.29 40.64,49.53 v40.64,49.02 | 52.7,50.55 v52.83,50.42 v52.83,74.68 52.83,74.17 52.7,74.04 | v45.72,76.07 45.47,76.32 U$3.13
LCD7  (via drill 0.6)
  Top 0.406: v55.5,74.68 53.34,76.83 v47.88,76.83 | v39.12,49.02 39.5,49.4 39.5,49.66 39.88,50.04 40.26,50.04 40.89,50.67 44.58,50.67 45.47,51.56 48.9,51.56 49.53,52.2 51.94,52.2 52.7,51.44 54.23,51.44 54.36,51.31 54.86,51.31 55.5,50.67 v55.5,50.42
  Bottom 0.406: v55.5,50.42 v55.5,74.68 | v47.88,76.83 48.01,76.97 U$3.14 | IC2.11 40.57,51.62 40.51,51.56 40.51,50.29 40.26,50.04 39.75,50.04 39.12,49.4 v39.12,49.02
LCD_E
  Bottom 0.406: IC2.23 34.98,60.33 29.72,60.33 27.69,62.35 U$3.6
LCD_RS  (via drill 0.6)
  Top 0.406: v35.31,62.87 30.99,62.87 29.84,64.01 24.51,64.01 23.88,63.37 23.88,62.99 23.62,62.74 v22.73,62.74
  Bottom 0.406: IC2.25 36.42,62.87 v35.31,62.87 | v22.73,62.74 22.61,62.86 U$3.4
LCD_RW  (via drill 0.6)
  Top 0.406: v25.15,62.87 v29.21,62.87
  Bottom 0.406: IC2.24 34.96,61.34 30.61,61.34 29.21,62.74 v29.21,62.87 | v25.15,62.87 U$3.5
LFT1  (via drill 0.6)
  Top 0.406: R7.1 25.37,29.83 U3.5 25.72,26.73 25.02,26.04 19.68,26.04 v18.67,27.05 | IC3.13 14.63,34.8 v18.54,34.8
  Bottom 0.406: v18.54,34.8 18.67,34.67 v18.67,27.05
LFT2  (via drill 0.6)
  Top 0.406: R16.1 58.66,29.83 U7.5 58.71,29.17 v58.93,28.7 | v60.07,25.53 v73.03,25.53
  Bottom 0.406: IC5.13 74.17,34.92 73.03,33.78 v73.03,25.53 | v60.07,25.53 58.93,26.67 v58.93,28.7
MENU
  Top 0.406: IC3.4 3.43,34.92 2.03,33.53 2.03,19.05 3.02,18.06 S4.3 S4.4 34.01,17.78 R22.1
MISO  (via drill 0.6)
  Top 0.406: v75.56,49.91 74.68,49.91 74.17,49.4 49.28,49.4 49.02,49.66 46.48,49.66 45.97,49.15 45.97,48.9 45.09,48.01 37.34,48.01 36.83,48.51 v35.94,48.51 | v74.04,84.71 73.41,84.71 72.9,85.22 64.01,85.22 63.37,85.85 57.4,85.85 56.39,86.87 51.44,86.87 51.18,87.12 47.24,87.12 45.72,88.65 JP2.3
  Bottom 0.406: v35.94,48.51 36.2,48.51 36.58,48.9 IC2.16 | v75.56,49.91 75.69,50.04 75.69,59.69 | 75.69,59.69 76.33,60.33 IC4.11 | 75.69,59.69 75.44,59.69 74.42,60.71 74.42,84.33 v74.04,84.71 74.04,87.25 J1.1
MOSI  (via drill 0.6)
  Top 0.406: IC1.14 49.94,33.53 48.26,33.53 46.35,35.43 46.35,36.96 44.83,38.48 v41.91,38.48 | v66.8,45.34 66.67,45.21 v41.4,45.21 | v48.26,85.98 55.88,85.98 57.02,84.84 63.12,84.84 63.75,84.2 v65.28,84.2
  Bottom 0.406: 40.64,45.09 40.64,46.99 40.01,47.62 38.61,47.62 37.34,48.9 37.34,53.34 37.37,53.37 IC2.15 | v66.8,45.34 66.8,66.04 66.55,66.29 66.04,66.29 65.66,66.67 65.66,67.06 65.79,67.18 65.79,67.94 65.66,68.07 65.66,68.83 65.91,69.09 65.91,83.57 v65.28,84.2 65.28,91.19 65.79,91.69 74.42,91.69 J1.4 | v41.4,45.21 41.27,45.09 40.64,45.09 | 40.64,45.09 40.64,39.5 41.66,38.48 v41.91,38.48 | v48.26,85.98 JP2.4
N$1
  Top 0.406: R1.1 36.99,36.05 LED1.A
N$2
  Top 0.406: R2.1 27.94,40.64 28.77,39.8 LED2.A
N$3
  Top 0.406: R3.1 23.97,32.53 LED3.A
N$4
  Top 0.406: R4.1 32.19,29 LED4.A
N$5
  Top 0.406: R24.1 LED9.A
N$6  (via drill 0.6)
  Top 0.406: C11.1 v21.59,7.62
  Bottom 0.406: v21.59,7.62 20.95,8.26 20.95,9.65 18.41,12.19 U10.1
N$7  (via drill 0.6)
  Top 0.406: v37.59,69.72 37.97,70.1 42.8,70.1 43.18,69.72 44.45,69.72 44.83,69.34 44.83,68.71 45.09,68.45 58.55,68.45 v59.05,68.96 | v60.2,87 S3.3 S3.4 64.39,86.11 66.29,86.11 66.42,85.98 74.8,85.98 76.2,84.58 82.04,84.58 82.42,84.2 v82.55,84.33 82.42,83.95 | v82.8,87 C9.2 R19.2
  Bottom 0.406: IC2.29 39.75,62.73 39.75,64.01 39.5,64.26 39.5,65.41 37.59,67.31 v37.59,69.72 | v59.05,68.96 58.8,69.22 58.8,85.72 60.07,87 v60.2,87 | v82.55,84.33 82.93,84.71 v82.8,87
N$8
  Bottom 0.406: IC2.20 35.06,58.04 28.45,58.04 28.18,57.77 C10.2
N$9  (via drill 0.6)
  Top 0.406: v16.13,7.62 C11.2
  Bottom 0.406: v16.13,7.62 15.88,7.87 U10.3
N$10
  Top 0.406: R10.1 70.75,35.31 69.34,35.31 68.6,36.05 LED5.A
N$11
  Top 0.406: R11.1 61.69,39.48 LED6.A
N$12
  Top 0.406: R12.1 55.69,32.43 LED7.A
N$13
  Top 0.406: R13.1 65.2,29 LED8.A
N$14
  Bottom 0.406: Q1.2 49.64,42.02 C16.2 49.53,47.1 49.53,54.61 47.72,56.42 IC2.7
N$15  (via drill 0.6)
  Top 0.406: S6.3 S6.4 v85.09,5.08 | v88.9,25.4 78.74,25.4 77.34,24 77.34,22.1 76.71,21.46 72.01,21.46 71.25,22.23 69.47,22.23 68.33,21.08 48.13,21.08 46.99,22.23 45.47,22.23 43.94,20.7 25.65,20.7 23.37,22.99 16.26,22.99 15.88,23.37 v15.49,23.37 | v15.24,76.2 v10.16,76.2
  Bottom 0.406: v85.09,5.08 87.63,7.62 87.63,17.78 87.3,18.11 U9.HB 88.9,20.65 v88.9,25.4 | v15.49,23.37 15.24,23.62 v15.24,76.2 | v10.16,76.2 11.56,77.6 11.56,83.06 10.41,84.2 10.41,89.53 12.32,91.44 U$5.2
N$16  (via drill 0.6)
  Top 0.406: IC3.10 14.38,30.99 v11.81,30.99 | v81.79,22.23 81.79,21.72 80.64,20.57 76.71,20.57 75.82,19.68 25.15,19.68 22.61,22.23 13.34,22.23 v11.43,24.13
  Bottom 0.406: v11.81,30.99 11.43,30.61 v11.43,24.13 | IC5.9 79.48,27.96 79.88,27.56 79.88,24.13 v81.79,22.23
N$17
  Bottom 0.406: U$3.3 20.32,80.52 20.32,83.82 21.59,85.09 25.4,85.09 25.65,84.84 28.07,84.84 28.32,85.09 R21.2
N$18
  Bottom 0.406: R21.1 33.02,85.71 33.02,87.63 U$4.1
N$19
  Bottom 0.406: C12.1 12.71,8.26 13.97,8.26 14.61,8.89 U10.4
N$20  (via drill 0.6)
  Top 0.406: U$3.15 49.02,78.74 45.72,78.74 45.47,78.99 43.18,78.99 42.67,78.49 17.27,78.49 17.14,78.61 v16.26,78.61 16.51,78.61
  Bottom 0.406: v16.26,78.61 16.26,83.69 17.13,84.57 R20.2
N$21
  Bottom 0.406: C12.2 13.34,10.18 U10.5
N$22
  Bottom 0.406: C14.1 12.06,11.45 U10.6
N$23
  Bottom 0.406: C13.2 17.14,10.18 U10.2
N$24  (via drill 0.6)
  Top 0.406: v21.34,11.43 29.46,11.43 31.75,13.72 34.54,13.72 36.45,11.81 44.32,11.81 44.7,12.19 47.24,12.19 47.62,11.81 59.94,11.81 61.19,10.56 X1.2
  Bottom 0.406: U10.14 16,19.7 16,18.16 16.26,17.91 20.95,17.91 21.97,16.89 21.97,11.94 21.46,11.43 v21.34,11.43
N$25  (via drill 0.6)
  Top 0.406: v20.83,13.21 21.34,12.7 22.35,12.7 22.86,12.19 28.96,12.19 31.24,14.48 35.05,14.48 36.83,12.7 43.81,12.7 44.07,12.95 47.62,12.95 48.01,12.57 56.39,12.57 57.02,13.21 v58.17,13.21 58.04,13.21
  Bottom 0.406: U10.13 14.73,19.7 14.73,18.29 15.88,17.14 20.19,17.14 21.34,16 21.34,13.46 21.08,13.21 v20.83,13.21 | v58.17,13.21 58.42,12.95 X1.3
N$26
  Bottom 0.406: Q1.1 44.44,41.92 C15.2 44.45,47.01 44.45,54.61 43.66,55.4 IC2.8
N$27  (via drill 0.6)
  Top 0.406: v52.96,44.2 v57.91,44.2 | v47.62,27.81 48.13,27.3 IC1.9
  Bottom 0.406: IC6.14 59.69,61.59 59.18,61.09 59.18,56.77 59.69,56.26 59.69,53.85 58.55,52.7 58.55,47.75 59.05,47.24 59.05,45.21 58.04,44.2 v57.91,44.2 | v52.96,44.2 52.83,44.07 51.56,44.07 50.93,43.43 50.93,40.77 49.91,39.75 49.91,29.84 47.88,27.81 v47.62,27.81
ON/OFF  (via drill 0.6)
  Top 0.406: IC3.5 4.45,33.66 3.3,32.51 v3.3,20.7 | v3.3,16.64 3.43,16.51 58.42,16.51 59.97,18.06 S5.3 S5.4 67.03,17.78 R23.1
  Bottom 0.406: v3.3,16.64 v3.3,20.7
RED1  (via drill 0.6)
  Top 0.406: v53.09,34.92 IC1.15 | v54.1,24 53.09,22.99 35.69,22.99 34.54,24.13 v25.15,24.13 | 25.13,42.56 v25.02,42.67 25.02,41.64 R2.2
  Bottom 0.406: v53.09,34.92 52.96,34.8 52.96,29.72 54.1,28.57 v54.1,24 | v25.15,24.13 25.02,24.26 v25.02,42.67
RED2  (via drill 0.6)
  Top 0.406: IC1.4 v45.97,32.38 | v46.23,40.77 46.35,40.64 50.29,40.64 51.56,41.91 61.98,41.91 63.63,41.91 64.15,41.39 R11.2
  Bottom 0.406: v45.97,32.38 46.23,32.64 v46.23,40.77
RESET
  Top 0.406: J1.5 78.87,87.76 80.9,87.76 81.41,88.27 81.41,89.28 81.93,89.8 C9.1
RHT1  (via drill 0.6)
  Top 0.406: R6.1 36.8,38.75 U4.5 35.24,40.32 v35.18,40.39 | IC3.14 14.63,36.07 v16.89,36.07 | v17.02,42.93 18.54,44.45 22.1,44.45 22.48,44.83 34.29,44.83 35.05,44.07 v35.31,44.07
  Bottom 0.406: v16.89,36.07 17.02,36.2 v17.02,42.93 | v35.31,44.07 35.18,43.94 v35.18,40.39
RHT2  (via drill 0.6)
  Top 0.406: U8.5 69.82,38.75 R15.1 70.12,38.99 70.61,38.99 71.5,39.88 74.17,39.88 75.44,38.61 75.44,36.83 76.07,36.2 v77.09,36.2
  Bottom 0.406: v77.09,36.2 IC5.14
RX_TO_PROC  (via drill 0.6)
  Top 0.406: v13.97,64.14 14.22,63.88 20.19,63.88 21.84,65.53 30.35,65.53 31.11,64.77 38.86,64.77 40.51,66.42 v40.51,67.44
  Bottom 0.406: U10.12 13.46,19.95 13.46,26.67 13.08,27.05 13.08,28.83 13.97,29.72 v13.97,64.14 | v40.51,67.44 40.26,67.18 40.26,64.52 40.57,64.2 IC2.30
SHIFT_RESULT  (via drill 0.6)
  Top 0.406: v6.22,31.11 IC3.7 | v5.71,61.59 v75.69,61.59
  Bottom 0.406: v6.22,31.11 6.1,31.24 6.1,38.73 5.71,39.12 v5.71,61.59 | v75.69,61.59 IC4.12
TEMP  (via drill 0.6)
  Top 0.406: v34.29,67.56 34.42,67.44 38.61,67.44 39.88,68.71 41.27,68.71 42.29,67.69 v67.06,67.69
  Bottom 0.406: IC2.28 38.99,62.73 38.99,63.37 38.86,63.5 38.86,64.52 37.85,65.53 34.29,65.53 33.53,66.29 33.53,67.06 34.04,67.56 v34.29,67.56 | v67.06,67.69 66.67,68.07 U$6.2
TX_FROM_PROC  (via drill 0.6)
  Top 0.406: v11.56,62.74 11.68,62.87 20.83,62.87 22.73,64.77 30.1,64.77 30.73,64.14 40.13,64.14 v41.4,65.41
  Bottom 0.406: U10.11 12.06,21.59 12.7,22.23 12.7,26.54 12.19,27.05 12.19,29.08 13.08,29.97 13.08,32.26 12.45,32.89 12.06,32.89 11.56,33.4 v11.56,62.74 | v41.4,65.41 41.37,65.37 IC2.31
UP1  (via drill 0.6)
  Top 0.406: U1.5 26.92,37.01 26.92,36.83 26.42,36.32 24.38,36.32 23.26,37.45 R9.1 19.7,37.45 v19.68,37.47 | IC3.11 v19.68,32.38
  Bottom 0.406: v19.68,32.38 v19.68,37.47
UP2  (via drill 0.6)
  Top 0.406: U5.5 60.21,36.84 59.56,36.2 58.29,36.2 58.04,35.94 57.55,35.94 R18.1 57.78,35.19 v57.91,34.42 | v57.66,24.13 v74.17,24.13
  Bottom 0.406: IC5.11 79.35,32.26 74.68,32.26 74.17,31.75 v74.17,24.13 | v57.91,34.42 57.66,34.42 v57.66,24.13
VCC  (via drill 0.6)
  Top 0.406: U6.4 69.1,31.23 70.36,29.97 70.98,29.97 R17.2 71.39,29.83 71.88,29.34 71.88,26.78 C6.1 78.74,26.67 v78.87,26.54 v81.41,26.54 | U5.4 58.74,37.45 C5.1 | U7.4 57.2,31.18 R16.2 56.53,31.13 55.88,30.48 55.88,29.73 C7.1 55.36,29.21 53.98,29.21 53.34,28.57 52.96,28.57 | R14.2 68.58,40.02 R15.2 70.48,40.66 v75.18,40.66 75.19,40.64 78.74,40.64 79.38,40.01 v80.01,40.01 80,40.02 | U8.4 68.88,36.83 C8.1 70.47,37.45 70.87,37.85 73.15,37.85 v73.53,37.47 | C5.1 57.04,36.96 56.26,36.96 55.99,36.69 R18.2 | U2.4 35.38,30.73 38.1,30.73 38.75,31.38 R8.2 C2.1 38.73,28.94 38.73,28.19 38.35,27.81 36.58,27.81 v35.81,27.05 | 25.58,30.99 C3.1 23.64,30.37 22.99,29.72 22.99,27.81 23.5,27.3 24.11,27.3 R7.2 20.69,27.29 v20.57,27.18 | U1.4 24.42,38.75 R9.2 | U4.4 35.35,37.34 37.34,37.34 37.85,37.85 37.85,38.1 | 37.85,39.37 37.85,39.5 37.32,40.02 R6.2 36.94,40.13 C4.1 36.67,42.56 R5.2 30.37,42.67 v29.21,42.67 | IC3.16 14.52,38.75 18.03,38.75 | 19.94,38.75 18.03,38.75 | 19.94,38.75 R9.2 | 52.96,28.57 IC1.10 | C1.1 22.86,40.62 R9.2 | v84.58,84.2 84.58,84.07 83.69,83.19 81.28,83.19 81.03,83.44 78.11,83.44 v77.98,83.57 73.28,83.57 72.77,84.07 v72.14,84.07 71.88,84.07 70.99,83.19 62.48,83.19 v62.1,83.57 | v84.58,86.87 85.34,86.87 85.6,87.12 85.6,89.41 85.2,89.8 R19.1 | J1.2 71.12,87.63 U$6.1 68.2,87.25 65.41,87.25 64.64,88.01 v52.07,88.01 | v52.45,82.93 51.94,83.44 51.94,83.69 51.69,83.95 50.04,83.95 49.66,83.57 41.27,83.57 41.02,83.82 | 41.02,83.82 v40.64,83.82 | v34.04,69.47 34.42,69.85 36.07,69.85 36.32,70.1 36.32,70.48 36.7,70.87 39.12,70.87 39.24,70.74 43.18,70.74 43.56,70.36 44.83,70.36 45.85,69.34 v46.35,69.47
  Top 0.406: 41.02,83.82 v34.04,83.82 34.04,84.07 U$4.2 v19.3,91.44 19.18,91.31 19.18,83.31 17.53,81.67 U$3.2 | v40.39,17.78 R22.2 | R23.2 77.47,17.78 77.8,18.11 U9.HA | 25.58,30.99 U3.4 | 25.58,30.99 23.62,30.99 23.62,31.62 22.86,32.38 21.97,32.38 20.83,33.53 20.32,33.53 19.68,34.16 19.68,35.81 19.05,36.45 18.67,36.45 18.03,37.08 18.03,38.75 | v29.46,48.39 v21.21,48.39 | v19.94,39.62 19.94,38.75 | 37.85,38.1 37.85,39.37 | 37.85,39.37 37.21,40.01 36.96,40.01 36.96,42.42 36.83,42.55 36.83,43.31 37.21,43.69 v37.21,43.94 | IC1.16 50.06,36.6 v52.96,39.5 v55.88,39.5 55.88,39.12 56.64,38.35 56.64,38.1 57.15,37.59 57.39,37.59 C5.1 | v52.96,27.81 52.96,28.57 | v38.1,36.83 37.85,37.08 37.85,38.1
  Bottom 0.406: v80.01,40.01 80.01,39.27 IC5.16 80.64,38.73 81.28,38.1 81.28,26.67 v81.41,26.54 | IC4.16 77.98,66.9 v77.98,83.57 | v84.58,84.2 v84.58,86.87 | C13.1 JP1.3 31.67,3.81 J2.GND | J2.GND 36.02,8.16 J2.GNDBREAK 40.39,10.83 v40.39,17.78 39.88,17.78 35.81,21.84 v35.81,27.05 35.81,35.31 37.34,36.83 v38.1,36.83 | v72.14,84.07 72.01,84.2 72.01,88.52 J1.2 | v52.45,82.93 52.45,83.06 52.07,83.44 v52.07,88.01 53.34,89.28 JP2.6 | U$5.3 12.83,86.49 15.11,86.49 16.26,87.63 16.26,90.55 17.14,91.44 v19.3,91.44 | v34.04,69.47 v34.04,83.82 | v46.35,69.47 45.97,68.96 45.97,60.07 44.72,58.82 IC2.4 43.55,58.93 42.16,58.93 41.78,58.55 41.78,57.78 42.35,57.22 IC2.6 43.61,57.28 37.08,57.28 36.23,56.42 IC2.18 33.75,56.42 33.53,56.64 30.23,56.64 29.59,56.01 29.59,48.39 | U10.16 20.57,21.98 v20.57,27.18 | v78.87,26.54 79.25,26.16 79.25,22.45 U9.A1 79.2,20.45 U9.HA 74.88,16.13 55.88,16.13 54.61,17.4 C17.1 | C17.1 51.18,14.35 51.18,5.97 50.37,5.16 J2.GND | v29.21,42.67 29.46,42.8 29.46,47.37 | 29.46,47.37 v29.46,48.39 | v21.21,48.39 19.94,47.12 v19.94,39.62 | v37.21,43.94 37.21,44.83 33.66,48.39 29.59,48.39 | 29.59,48.39 v29.46,48.39 | v29.46,48.39 29.34,48.39 29.46,48.26 29.46,47.37 | C17.1 56.64,19.81 56.64,38.99 56.13,39.5 v55.88,39.5 | v52.96,39.5 52.96,36.58 52.07,35.69 52.07,34.04 52.32,33.78 52.32,29.34 52.96,28.7 v52.96,27.81 | v75.18,40.66 73.53,38.5 v73.53,37.47 | v62.1,83.57 62.1,66.27 IC6.16 65.28,64.14 66.04,63.37 66.04,57.02 65.53,56.52 IC6.10
WHT1  (via drill 0.6)
  Top 0.406: v40.64,33.66 IC1.3 | v28.19,27.18 28.96,27.94 R4.2 | v34.16,25.15 34.29,25.27 39.5,25.27 40.64,26.42 v40.64,27.18
  Bottom 0.406: v40.64,27.18 v40.64,33.66 | v28.19,27.18 30.23,25.15 v34.16,25.15
WHT2
  Top 0.406: R13.2 61.45,26.54 54.61,26.54 54.23,26.16 46.99,26.16 45.97,27.18 45.97,28.07 45.47,28.57 IC1.7
WHT3  (via drill 0.6)
  Top 0.406: v57.91,46.23 57.53,46.61 43.81,46.61 43.56,46.35 v43.18,46.35 | v42.29,17.78 42.55,18.03 R24.2
  Bottom 0.406: IC6.15 64.11,62.99 58.67,62.99 58.42,62.74 58.42,56.39 58.93,55.88 58.93,54.1 57.91,53.09 v57.91,46.23 | v43.18,46.35 42.93,46.1 42.93,18.54 42.29,17.91 v42.29,17.78

### Text on the board
tPlace: 1 | ALC | LCD | Reset | AVR PRG | GND | CLK | MISO | MOSI | CS | VCC | Matrix UI Board Rev 1 | Evan Green 10/2010 | Menu | On/Off | AUDIO | GND | VCC | Gas On | +5V